# Altium project power_board.PrjPcb (part 2 of 2)

## Sheet MPPT_Measurements.SchDoc
size C
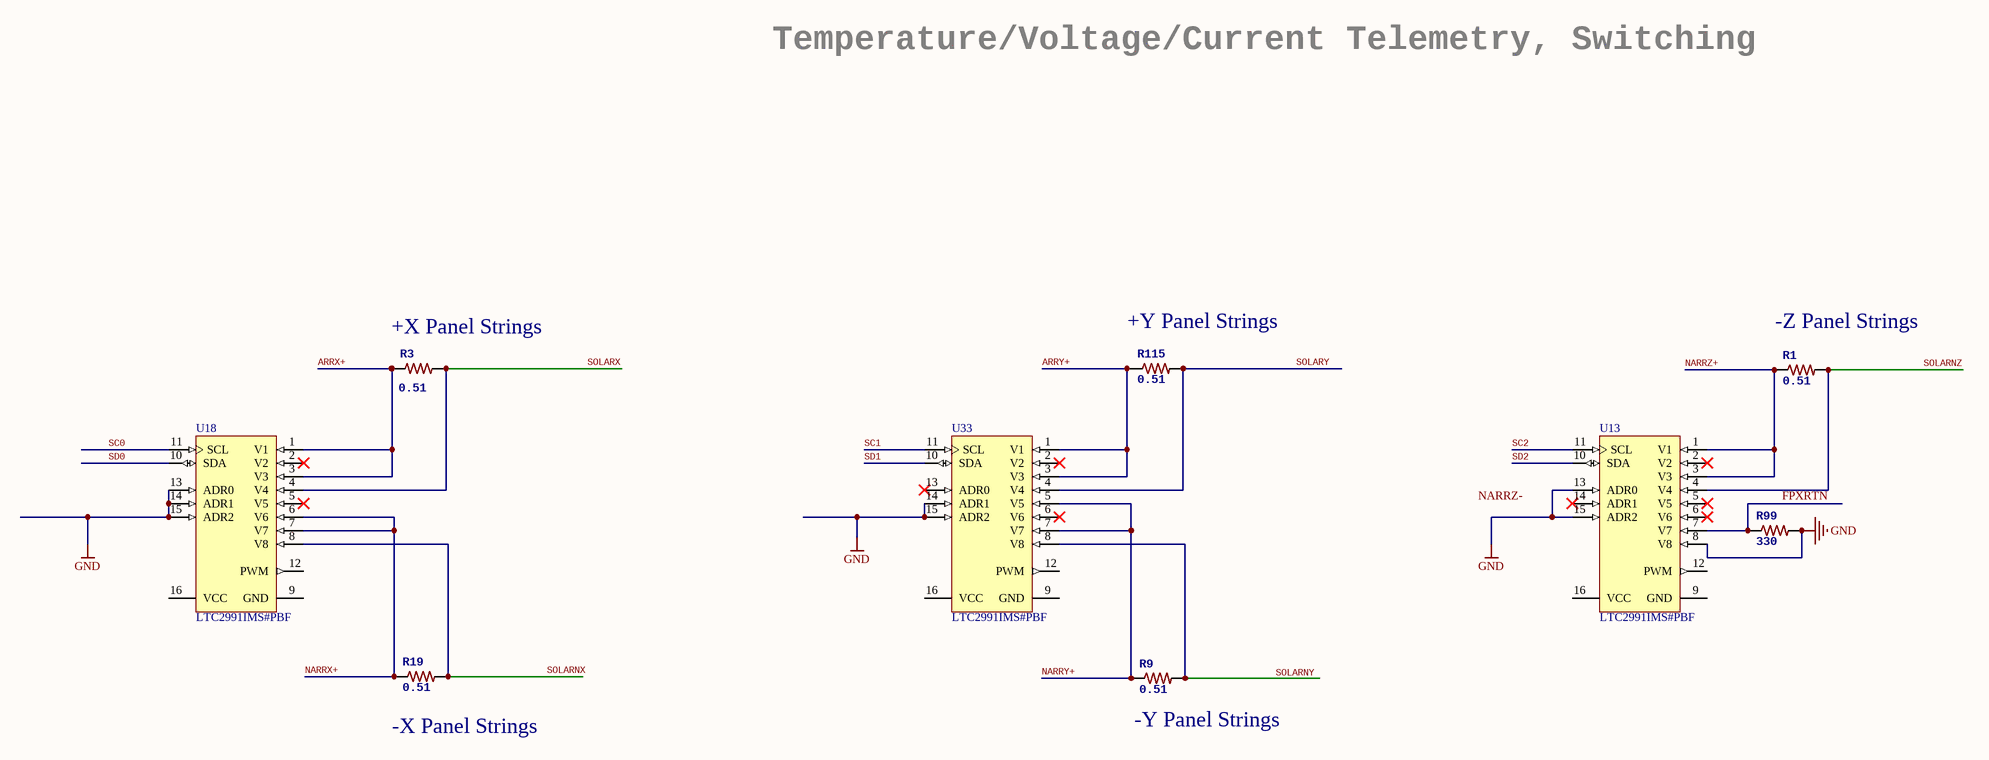
[diagram p5: MPPT_Measurements.SchDoc]

### Parts
R1  0.51  [RESC1220X06N]
R3  0.51  [RESC1220X06N]
R9  0.51  [RESC1220X06N]
R19  0.51  [RESC1220X06N]
R99  330  [0603-RES]
R115  0.51  [RESC1220X06N]
U13  LTC2991IMS#PBF  [LT-MS-16_N]
U18  LTC2991IMS#PBF  [LT-MS-16_N]
U33  LTC2991IMS#PBF  [LT-MS-16_N]

### Nets
GND: R99.2 U13.8(V8) U13.13(ADR0) U13.15(ADR2) U18.13(ADR0) U18.14(ADR1) U18.15(ADR2) U33.14(ADR1) U33.15(ADR2)  [project net ARRAYNX.3.NEG.NEG]
ARRX+: R3.1 U18.1(V1) U18.3(V3)  [project net ARRAYX.1.POS.POS]
ARRY+: R115.1 U33.1(V1) U33.3(V3)  [project net ARRAYY.1.POS.POS]
FPXRTN: R99.1 U13.7(V7)
NARRX+: R19.1 U18.6(V6) U18.7(V7)  [project net ARRAYNX.1.POS.POS]
NARRY+: R9.1 U33.5(V5) U33.7(V7)  [project net ARRAYNY.1.POS.POS]
NARRZ+: R1.1 U13.1(V1) U13.3(V3)  [project net ARRAYNZ.1.POS.POS]
SC0: U18.11(SCL)  [project net ARRAYNX.10.SCL.SCL]
SC1: U33.11(SCL)  [project net ARRAYNY.10.SCL.SCL]
SC2: U13.11(SCL)  [project net ARRAYNZ.9.SCL.SCL]
SD0: U18.10(SDA)  [project net ARRAYNX.7.SDA.SDA]
SD1: U33.10(SDA)  [project net ARRAYNY.7.SDA.SDA]
SD2: U13.10(SDA)  [project net ARRAYNZ.7.SDA.SDA]
SOLARNX: R19.2 U18.8(V8)
SOLARNZ: R1.2 U13.4(V4)
SOLARX: R3.2 U18.4(V4)
SOLARY: R115.2 U33.4(V4)
NetR9_2: R9.2 U33.8(V8)

Not connected (* = marked no-connect by the designer): U13 2(V2)* 5(V5)* 6(V6)* 9(GND) 12(PWM) 14(ADR1)* 16(VCC); U18 2(V2)* 5(V5)* 9(GND) 12(PWM) 16(VCC); U33 2(V2)* 6(V6)* 9(GND) 12(PWM) 13(ADR0)* 16(VCC)

### Notes on the sheet
- Temperature/Voltage/Current Telemetry, Switching
- (near R3) +X Panel Strings
- (near R115) +Y Panel Strings
- (near R1) -Z Panel Strings
- (near R19) -X Panel Strings
- (near R9) -Y Panel Strings
- Labels drawn without touching a wire or pin: NARRZ-, SOLARNY

### Library data of the parts
R1 R9 R19 R115 = RESISTOR: <b>Resistor</b> / Basic schematic elements and footprints for 0603, 1206, and PTH resistors.; Supplier 1: Digi-Key; Supplier Part Number 1: RHM.51BSTR-ND; Value: 0.51
R3 = RESISTOR: <b>Resistor</b> / Basic schematic elements and footprints for 0603, 1206, and PTH resistors.; pin to pad: A1 A2 A3>P2 B1 B2 B3>P1; Supplier 1: Digi-Key; Supplier Part Number 1: RHM.51BSTR-ND; Value: 0.51
R99 = RESISTOR0805-RES_333: Manufacturer: TE Connectivity; Manufacturer Part Number: 1625856-2; Tolerance: ±10%; Power (Watts): 0.125W, 1/8W; Temperature Coefficient: ±100ppm/°C; RoHS: RoHS Compliant; Category: Resistors; Packaging: Cut Tape (CT); Value: 330; Composition: Thick Film; Features: -; Operating Temperature: -55°C ~ 125°C; Package / Case: 0805 (2012 Metric); Supplier Device Package: 0805; Size / Dimension: 0.079" L x 0.047" W (2.00mm x 1.20mm); Height: 0.020" (0.50mm); Number of Terminations: 2; ComponentLink1URL: http://www.te.com/commerce/DocumentDelivery/DDEController?Action=srchrtrv&DocNm=1625856&DocType=Customer+Drawing&DocLang=English; ComponentLink1Description: http://www.te.com/commerce/DocumentDelivery/DDEController?Action=srchrtrv&DocNm=1625856&DocType=Customer+Drawing&DocLang=English; Supplier 1: Digi-Key; Supplier Part Number 1: P332DBCT-ND
U13 U18 U33 = CMP-0482-00817-1: Octal I2C Voltage, Current, and Temperature Monitor, 16-pin SOP (MS-16), -40 to 85 degC, Pb-Free; Manufacturer: Linear Technology; Number of Supplies(#): 8; PackageDescription: 16-Pin Plastic MSOP, Body 4.04 x 3.00 mm, Pitch 0.50 mm; ComponentLink3Description: Package Specification; RoHS: TRUE; ComponentLink1URL: http://www.linear.com/; DatasheetVersion: Rev. B; ComponentLink1Description: Manufacturer URL; ComponentLink2Description: Datasheet; ComponentLink2URL: http://cds.linear.com/docs/en/datasheet/2991fb.pdf; PackageReference: MS16; PartNumber: LTC2991IMS#PBF; PackageVersion: Rev. Ø, 06/2010; ComponentLink3URL: http://cds.linear.com/docs/en/packaging/05081669_A_MS16.pdf; Mounting Technology: Surface Mount

## Nets that join several sheets
3V3: power_board_2.SchDoc (H1.48 H1.50 H1.52 J3.4), power_board_uC (24 pins), BCR (19 pins)
5V: power_board_2.SchDoc (5 pins), BCR (26 pins)
ACS_5V: power_board_2.SchDoc (H2.27 H2.28), BCR (Q86.2)
ANTENNA: power_board_2.SchDoc (P6.1), BCR (Q88.2)
ARRAYNX.3.NEG.NEG: power_board_2.SchDoc (15 pins), power_board_uC (8 pins), MPPT-BCR (80 pins), BCR (64 pins), MPPT_Measurements (9 pins)
FIPEX_3.3V: power_board_2.SchDoc (H1.42), BCR (Q77.2)
FIPEX_5V: power_board_2.SchDoc (H1.45), BCR (Q87.2)
PTT: power_board_2.SchDoc (H1.44 H1.46), BCR (Q78.2)
ACS3.3V: power_board_2.SchDoc (H1.27 H1.28), BCR (Q76.2)
ARRAYNX.1.POS.POS: power_board_2.SchDoc (P2.1 P2.2), MPPT_Measurements (R19.1 U18.6 U18.7)
ARRAYNX.7.SDA.SDA: power_board_2.SchDoc (P1.7 P1.8 P2.7 P2.8), power_board_uC (R102.2 U2.4), MPPT_Measurements (U18.10)
ARRAYNX.10.SCL.SCL: power_board_2.SchDoc (P1.9 P1.10 P2.9 P2.10), power_board_uC (R103.2 U2.5), MPPT_Measurements (U18.11)
ARRAYNY.1.POS.POS: power_board_2.SchDoc (P4.1 P4.2), MPPT_Measurements (R9.1 U33.5 U33.7)
ARRAYNY.7.SDA.SDA: power_board_2.SchDoc (P3.7 P3.8 P4.7 P4.8), power_board_uC (R112.2 U2.6), MPPT_Measurements (U33.10)
ARRAYNY.10.SCL.SCL: power_board_2.SchDoc (P3.9 P3.10 P4.9 P4.10), power_board_uC (R113.2 U2.7), MPPT_Measurements (U33.11)
ARRAYNZ.1.POS.POS: power_board_2.SchDoc (P5.1), MPPT_Measurements (R1.1 U13.1 U13.3)
ARRAYNZ.7.SDA.SDA: power_board_2.SchDoc (P5.7), power_board_uC (R122.2 U2.8), MPPT_Measurements (U13.10)
ARRAYNZ.8.SDA.NC: power_board_2.SchDoc (H2.21 H2.45 H2.46 P5.8), BCR (5 pins)
ARRAYNZ.9.SCL.SCL: power_board_2.SchDoc (P5.9), power_board_uC (R123.2 U2.9), MPPT_Measurements (U13.11)
ARRAYX.1.POS.POS: power_board_2.SchDoc (P1.1 P1.2), MPPT_Measurements (R3.1 U18.1 U18.3)
ARRAYY.1.POS.POS: power_board_2.SchDoc (P3.1 P3.2), MPPT_Measurements (R115.1 U33.1 U33.3)
FPXRTN: power_board_2.SchDoc (P6.4), MPPT_Measurements (R99.1 U13.7)
RST: power_board_2.SchDoc (J3.1), power_board_uC (U1.2)
SC3: power_board_uC (R133.2 U2.11), BCR (U74.6 U75.6 U76.6)
SC5: power_board_uC (R152.2 U2.16), BCR (U83.6 U84.6 U85.6)
SD3: power_board_uC (R132.2 U2.10), BCR (U73.7 U74.7 U75.7 U76.7)
SD5: power_board_uC (R153.2 U2.15), BCR (U84.7 U85.7)
SOLARNX: MPPT-BCR (Cin2.1 Lx2.1 R23.2), MPPT_Measurements (R19.2 U18.8)
SOLARNZ: MPPT-BCR (Cin5.1 Lx5.1 R53.2), MPPT_Measurements (R1.2 U13.4)
SOLARX: MPPT-BCR (Cin1.1 Lx1.1 R13.2), MPPT_Measurements (R3.2 U18.4)
SOLARY: MPPT-BCR (Cin3.1 Lx3.1 R33.2), MPPT_Measurements (R115.2 U33.4)
ST1NX: power_board_uC (U1.14), MPPT-BCR (U22.4)
ST1X: power_board_uC (U1.7), MPPT-BCR (U12.4)
ST1Y: power_board_uC (U1.16), MPPT-BCR (U32.4)
ST2NX: power_board_uC (U1.15), MPPT-BCR (U22.3)
ST2X: power_board_uC (U1.8), MPPT-BCR (U12.3)
ST2Y: power_board_uC (U1.17), MPPT-BCR (U32.3)
STLINK-SWIM: power_board_2.SchDoc (J3.3), power_board_uC (U1.1)
Vchrg: MPPT-BCR (15 pins), BCR (U70.7 U70.8)